# Altium schematic sheet main.SchDoc
size A4; SheetNumber: 1; SheetTotal: 2
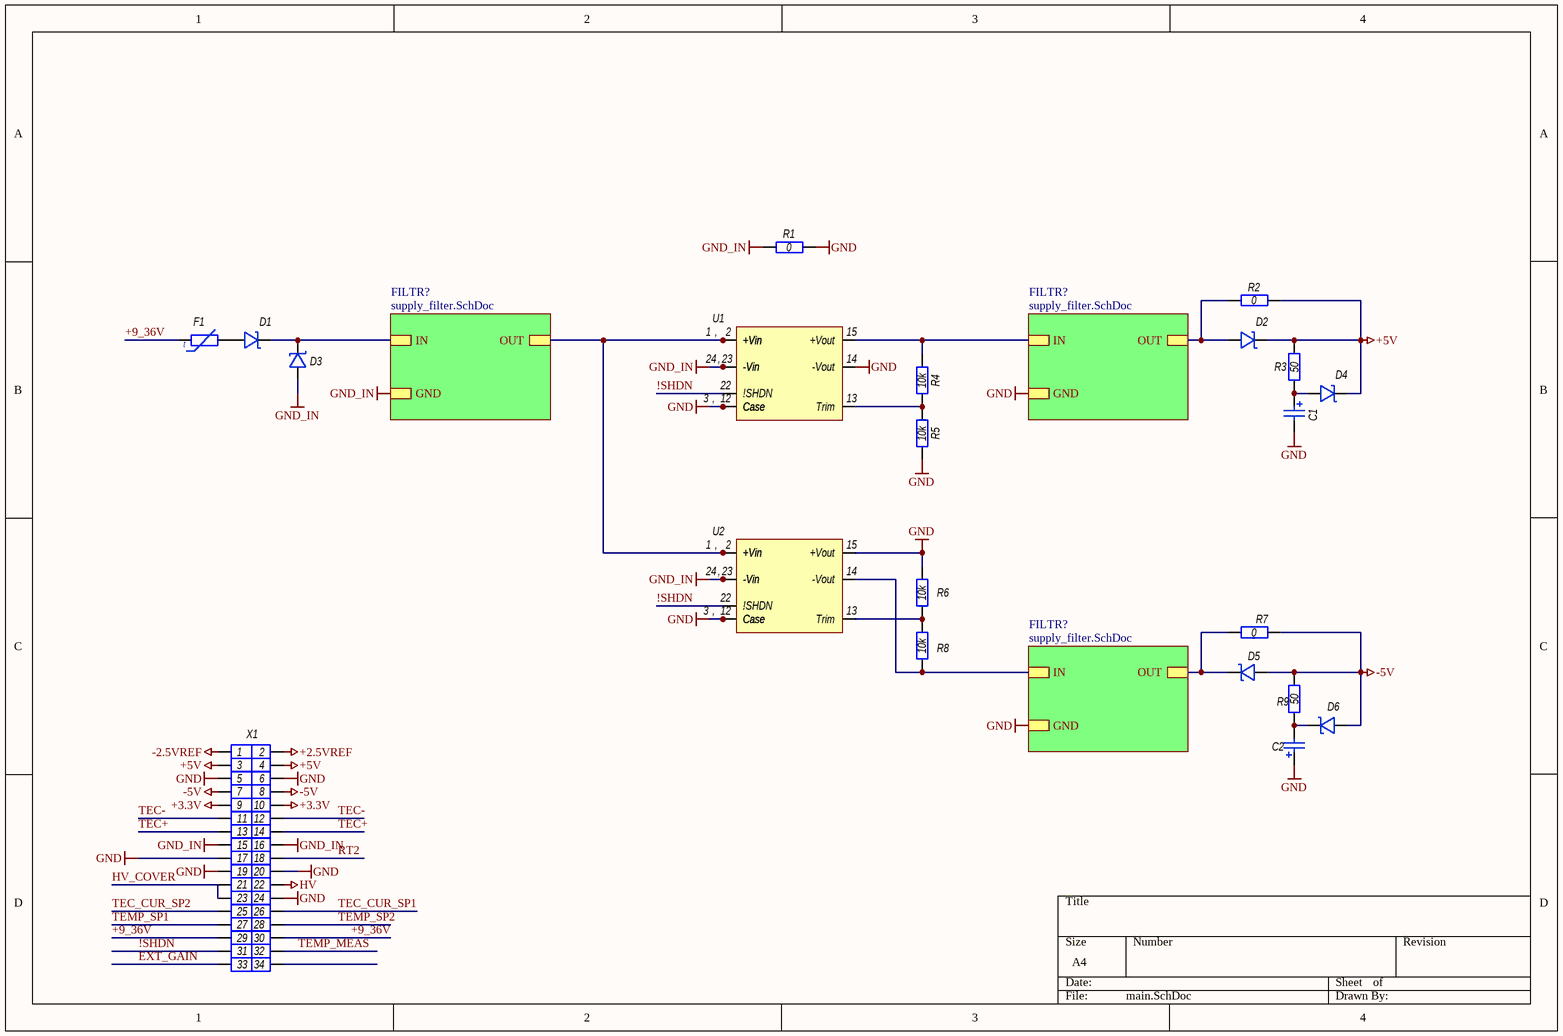
[diagram p0: main.SchDoc]

## Parts
C1  47u 63V  (value not drawn)
C2  47u 63V  (value not drawn)
D1  VS-15MQ040  [DO-214AC (SMA)]  (value not drawn)
D2  VS-15MQ040  [DO-214AC (SMA)]  (value not drawn)
D3  VS-15MQ040  [DO-214AC (SMA)]  (value not drawn)
D4  VS-15MQ040  [DO-214AC (SMA)]  (value not drawn)
D5  VS-15MQ040  [DO-214AC (SMA)]  (value not drawn)
D6  VS-15MQ040  [DO-214AC (SMA)]  (value not drawn)
F1  MF-NSMF035  [RES_1206]  (value not drawn)
R1  0  [RES_0603]
R2  0  [RES_0603]
R3  50  [RES_0603]
R4  10k  [RES_0603]
R5  10k  [RES_0603]
R6  10k  [RES_0603]
R7  0  [RES_0603]
R8  10k  [RES_0603]
R9  50  [RES_0603]
U1  TWN 5  [DCDC_TVN]  (value not drawn)
U2  TWN 5  [DCDC_TVN]  (value not drawn)
X1  ?  [BH-34]  (value not drawn)

## Sub-sheets
FILTR? = supply_filter.SchDoc: OUT, IN, GND
FILTR? = supply_filter.SchDoc: OUT, IN, GND
FILTR? = supply_filter.SchDoc: OUT, IN, GND

## Nets
+2.5VREF: X1.2
+3.3V: X1.9 X1.10
+5V: D2.2 D4.2 R2.2 R3.1 X1.3 X1.4
-2.5VREF: X1.1
-5V: D5.1 D6.1 R7.2 R9.1 X1.7 X1.8
GND: C1.2 C2.1 R1.2 R5.2 R6.1 U1.3(Case) U1.12(Case) U1.14(-Vout) U2.3(Case) U2.12(Case) U2.15(+Vout) X1.5 X1.6 X1.17 X1.19 X1.20 X1.24 ; sheet FILTR?/GND, sheet FILTR?/GND
GND_IN: D3.1 R1.1 U1.23(-Vin) U1.24(-Vin) U2.23(-Vin) U2.24(-Vin) X1.15 X1.16 ; sheet FILTR?/GND
HV: X1.22
!SHDN: U1.22(!SHDN) U2.22(!SHDN) X1.31
+9_36V: F1.1 X1.29 X1.30
EXT_GAIN: X1.33
HV_COVER: X1.21 X1.23
RT2: X1.18
TEC+: X1.13 X1.14
TEC-: X1.11 X1.12
TEC_CUR_SP1: X1.26
TEC_CUR_SP2: X1.25
TEMP_MEAS: X1.32
TEMP_SP1: X1.27
TEMP_SP2: X1.28
NetC1_1: C1.1 D4.1 R3.2
NetC2_2: C2.2 D6.2 R9.2
NetD1_1: D1.1 F1.2
NetD1_2: D1.2 D3.2 ; sheet FILTR?/IN
NetD2_1: D2.1 R2.1 ; sheet FILTR?/OUT
NetD5_2: D5.2 R7.1 ; sheet FILTR?/OUT
NetR4_1: R4.1 U1.15(+Vout) ; sheet FILTR?/IN
NetR4_2: R4.2 R5.1 U1.13(Trim)
NetR6_2: R6.2 R8.1 U2.13(Trim)
NetR8_2: R8.2 U2.14(-Vout) ; sheet FILTR?/IN
NetU1_1: U1.1(+Vin) U1.2(+Vin) U2.1(+Vin) U2.2(+Vin) ; sheet FILTR?/OUT

Not connected (* = marked no-connect by the designer): X1 34

## Notes on the sheet
- (in symbol MF-NSMFxxx) t
- (in symbol TWN 5) ,

## Library data of the parts
C1 C2 = CapacitorEl: Конденсатор электролитический; ValueBOM: 47u; ValueSCH: 47u 63V
D1-D6 = MBR0520: Диод Шоттки; MarkPCB: AYWLC; ValueBOM: MBR0520; ValueSCH: MBR0520; HelpURL: C:\Datasheets\MBR0520.pdf
F1 = MF-NSMFxxx: Предохранитель самовосстанавливаемый; ValueBOM: MF-NSMFxxx; ValueSCH: MF-NSMFxxx; HelpURL: C:\Datasheets\MF-NSMF.pdf
R1-R3 R7 R9 = Resisitor: Резистор; ValueBOM: 0805 10k 0.125; ValueSCH: 10k; MarkPCB: 103
R4-R6 R8 = Resisitor: Резистор; ValueBOM: 0805 10k 0.125; MarkPCB: 103; ValueSCH: 10k
U1 U2 = TWN 5: DC/DC модуль питания
X1 = Connector 17x2: ValueSCH: Model